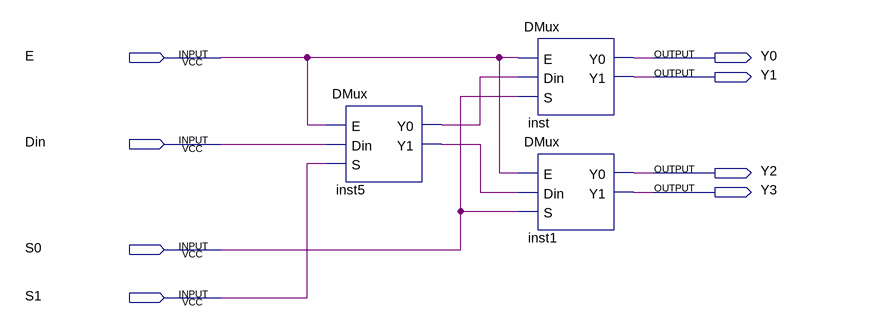
[diagram p0: schematic sheet]
// Quartus schematic DMux4Way.bdf as structural Verilog: 3 symbols, 8 pins
module DMux4Way (
  input  E,
  input  Din,
  input  S0,
  input  S1,
  output Y0,
  output Y1,
  output Y2,
  output Y3
);

  wire inst5_y0, inst5_y1;

  DMux inst5 (.E(E), .Din(Din), .S(S1), .Y0(inst5_y0), .Y1(inst5_y1));
  DMux inst (.E(E), .Din(inst5_y0), .S(S0), .Y0(Y0), .Y1(Y1));
  DMux inst1 (.E(E), .Din(inst5_y1), .S(S0), .Y0(Y2), .Y1(Y3));
endmodule
